# EAGLE design 3Ph FWR (EAGLE 9.6.2)
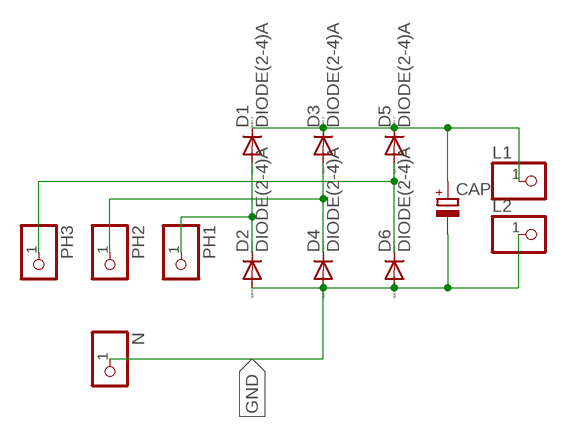
[diagram p0: schematic, sheet 1]

## Parts
CAP  CAP_POL  [E3,5-8]
D1  DIODE(2-4)A  [DO35-10]
D2  DIODE(2-4)A  [DO35-10]
D3  DIODE(2-4)A  [DO35-10]
D4  DIODE(2-4)A  [DO35-10]
D5  DIODE(2-4)A  [DO35-10]
D6  DIODE(2-4)A  [DO35-10]
L1  PINHD-1X1  [1X01]
L2  PINHD-1X1  [1X01]
N  PINHD-1X1  [1X01]
PH1  PINHD-1X1  [1X01]
PH2  PINHD-1X1  [1X01]
PH3  PINHD-1X1  [1X01]

## Nets
GND: CAP.- D2.A D4.A D6.A L2.1 N.1
N$1: D1.A D2.C PH1.1
N$2: D3.A D4.C PH2.1
N$3: D5.A D6.C PH3.1
N$4: CAP.+ D1.C D3.C D5.C L1.1

## Library data of the parts
CAP = MIA_LIBRARY-2-2-2:CAP_POL
D1-D6 = MIA_LIBRARY-2-2-2:DIODE(2-4)A: DIODE high speed (Philips)
L1 L2 N PH1-PH3 = pinhead:PINHD-1X1: PIN HEADER

## Board
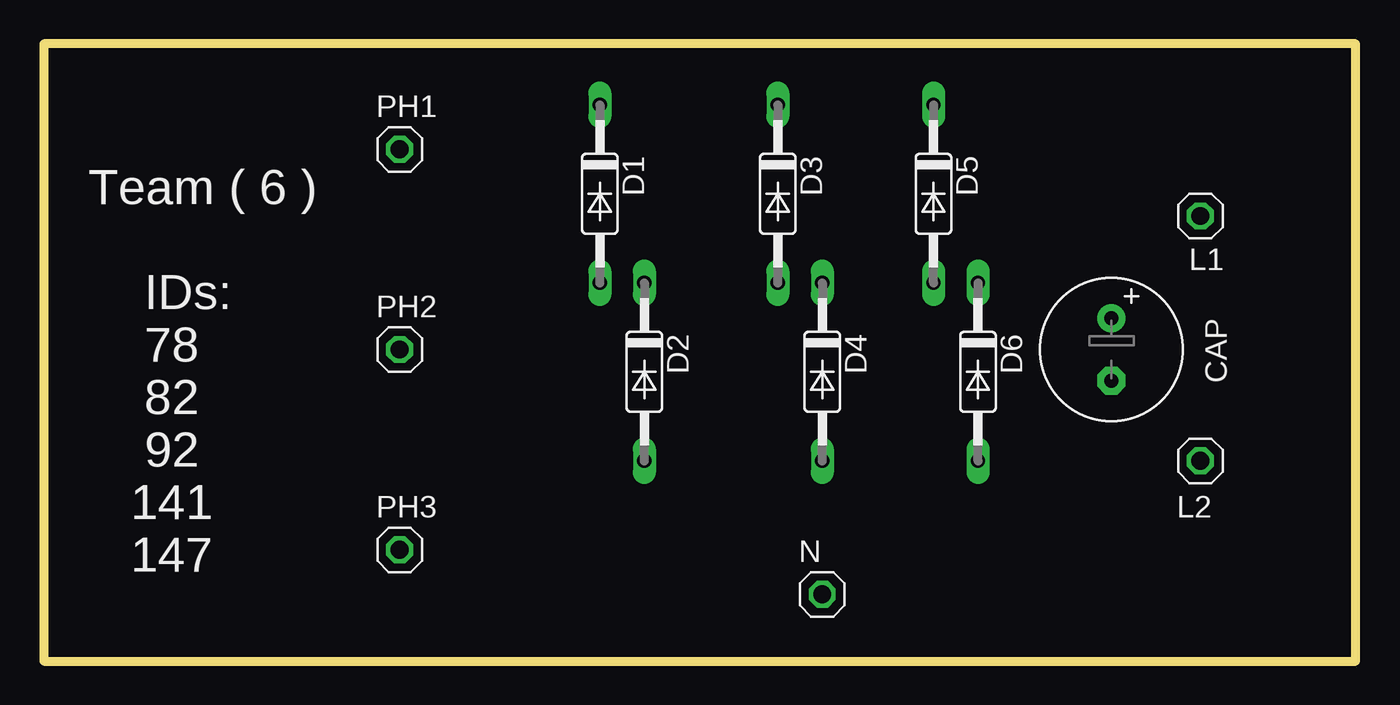
[diagram p1: board, top side]
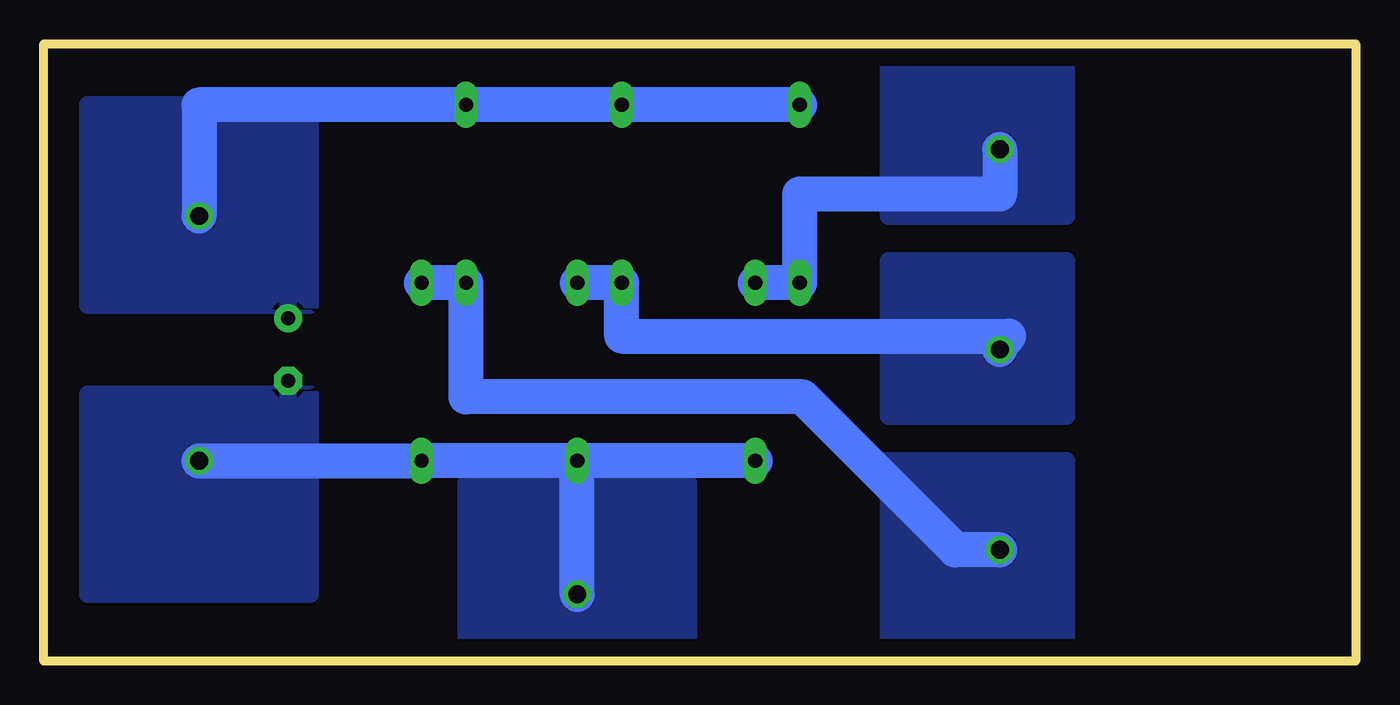
[diagram p2: board, bottom side, seen from below]

Size 74.91 x 35.23 mm. Coordinates in mm from the lower left corner, seen from the top.
Outline: 0,0 74.91,0 74.91,35.23 0,35.23 0,0
Copper layers (1*16): Top 0.035mm / dielectric 1.5mm / Bottom 0.035mm
Design rules "default *": minimum track width 1mm, minimum drill 0.35mm, track to track 0.7mm, track to pad 0.7mm, pad to pad 6mil, via to via 6mil, smd to smd 6mil, copper to edge 40mil, drill to drill 6mil, minimum pad ring 10mil, minimum via ring 8mil, stop-mask expansion 4mil, vias tented up to drill 0mil, thermal gap 10mil

### Footprints (pad centres in the part's own frame; a part is rotated, then mirrored left to right if it is on the bottom)
E3,5-8 = drill 0.813 pad 1.6: + -1.778,0 | drill 0.813 pad 1.6 octagon: - 1.778,0
DO35-10 = drill 0.813 long: A 5.08,0; C -5.08,0
1X01 = drill 1.016 octagon: 1 0,0

### Placement (x,y rotation side)
CAP  60.96,17.78 270 top
D1  31.75,26.67 270 top
D2  34.29,16.51 270 top
D3  41.91,26.67 270 top
D4  44.45,16.51 270 top
D5  50.8,26.67 270 top
D6  53.34,16.51 270 top
L1  66.04,25.4 180 top
L2  66.04,11.43 0 top
N  44.45,3.81 0 top
PH1  20.32,29.21 0 top
PH2  20.32,17.78 0 top
PH3  20.32,6.35 0 top

### Tracks (layer width: path | path; a pad name or v marks a point on that pad's centre or on a via)
GND
  Bottom 2: D2.A D4.A | D4.A D6.A L2.1 | N.1 D4.A
  pour Bottom: 59.69,15.24 72.39,15.24 72.39,3.81 59.69,3.81
  pour Bottom: 38.1,10.16 38.1,1.27 50.8,1.27 50.8,10.16
N$1
  Bottom 2: PH1.1 20.32,26.67 31.75,26.67 D1.A D2.C
  pour Bottom: 16.51,25.4 16.51,34.29 26.67,34.29 26.67,25.4
N$2
  Bottom 2: PH2.1 20.32,18.03 19.81,18.54 41.91,18.54 D3.A D4.C
  pour Bottom: 16.51,13.97 26.67,13.97 26.67,21.59 26.67,22.86 16.51,22.86
N$3
  Bottom 2: PH3.1 22.86,6.35 31.59,15.08 50.8,15.08 D5.A D6.C
  pour Bottom: 16.51,11.43 27.94,11.43 26.67,10.16 26.67,1.27 16.51,1.27
N$4
  Bottom 1: D3.C D5.C
  Bottom 2: D1.C D5.C 66.04,31.75 L1.1
  pour Bottom: 59.69,31.75 72.39,31.75 72.39,20.32 59.69,20.32

### Text on the board
tPlace: Team ( 6 ) / / IDs: / 78 / 82 / 92 / 141 / 147